# Altium schematic sheet LO.SchDoc
size A4
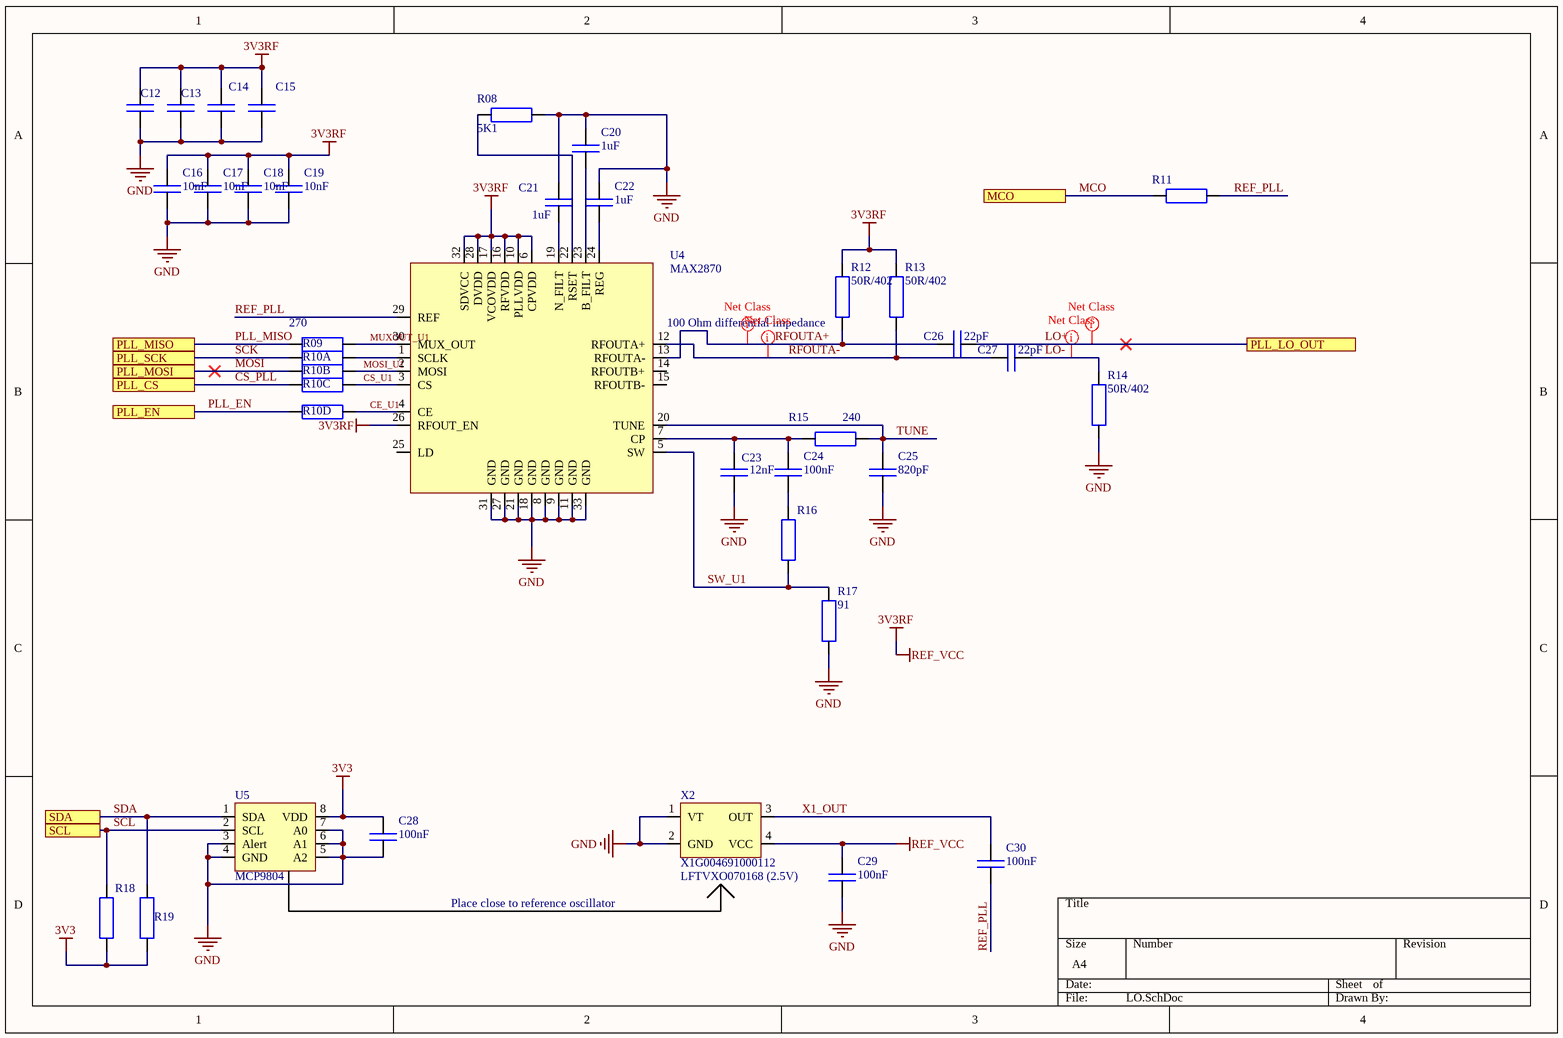
[diagram p0: LO.SchDoc]

## Parts
C12  100nF  [smd C0603_0.80]  (value not drawn)
C13  100nF  [smd C0603_0.80]  (value not drawn)
C14  100nF  [smd C0603_0.80]  (value not drawn)
C15  100nF  [smd C0603_0.80]  (value not drawn)
C16  10nF  [smd C0402]
C17  10nF  [smd C0402]
C18  10nF  [smd C0402]
C19  10nF  [smd C0402]
C20  1uF  [smd C0603_0.80]
C21  1uF  [smd C0603_0.80]
C22  1uF  [smd C0603_0.80]
C23  12nF  [smd C0603_0.80]
C24  100nF  [smd C0603_0.80]
C25  820pF  [smd C0603_0.80]
C26  22pF  [smd C0402]
C27  22pF  [smd C0402]
C28  100nF  [smd C0603_0.80]
C29  100nF  [smd C0603_0.80]
C30  100nF  [smd C0603_0.80]
R08  5K1  [smd C0603_0.45]
R09  270  [smd C0805_0.50]
R10  (no value)  [smd R EXB38v]  (parts A,B,C,D of 4)
R11  (no value)  [smd C0805_0.50]
R12  50R/402  [smd C0402_0.35]
R13  50R/402  [smd C0402_0.35]
R14  50R/402  [smd C0402_0.35]
R15  240  [smd C0603_0.45]
R16  (no value)  [smd C0603_0.45]
R17  91  [smd C0603_0.45]
R18  (no value)  [smd C0805_0.50]
R19  (no value)  [smd C0805_0.50]
U4  MAX2870  [MAXIM-T3255]
U5  MCP9804  [smd MSOP/8]
X2  X1G004691000112  [X1G004691000112]

## Ports
MCO, PLL_CS, PLL_EN, PLL_LO_OUT, PLL_MISO, PLL_MOSI, PLL_SCK, SCL, SDA

## Nets
3V3: C28.2 R18.2 R19.1 U5.8(VDD)
3V3RF: C12.2 C13.2 C14.2 C15.2 C16.2 C17.2 C18.2 C19.2 C29.2 R12.2 R13.2 U4.6(CPVDD) U4.10(PLLVDD) U4.16(RFVDD) U4.17(VCOVDD) U4.26(RFOUT_EN) U4.28(DVDD) U4.32(SDVCC) X2.4(VCC)  [also labelled REF_VCC]
GND: C12.1 C13.1 C14.1 C15.1 C16.1 C17.1 C18.1 C19.1 C20.1 C21.1 C22.1 C23.1 C25.1 C28.1 C29.1 R08.1 R14.1 R17.1 U4.8(GND) U4.9(GND) U4.11(GND) U4.18(GND) U4.21(GND) U4.27(GND) U4.31(GND) U4.33(GND) U5.3(Alert) U5.4(GND) U5.5(A2) U5.6(A1) U5.7(A0) X2.1(VT) X2.2(GND)
CE_U1: R10.8 U4.4(CE)
CS_PLL: R10.5 ; port PLL_CS
CS_U1: R10.6 U4.3(CS)
LO+: C26.2 ; port PLL_LO_OUT
LO-: C27.2 R14.2
MCO: R11.2 ; port MCO
MOSI: R10.3 ; port PLL_MOSI
MOSI_U1: R10.4 U4.2(MOSI)
MUXOUT_U1: R09.2 U4.30(MUX_OUT)
PLL_EN: R10.7 ; port PLL_EN
PLL_MISO: R09.1 ; port PLL_MISO
REF_PLL: C30.2 R11.1 U4.29(REF)
RFOUTA+: C26.1 R12.1 U4.13(RFOUTA-)
RFOUTA-: C27.1 R13.1 U4.12(RFOUTA+)
SCK: R10.1 ; port PLL_SCK
SCL: R18.1 U5.2(SCL) ; port SCL
SDA: R19.2 U5.1(SDA) ; port SDA
SW_U1: R16.1 R17.2 U4.5(SW)
TUNE: C25.2 R15.2 U4.20(TUNE)
X1_OUT: C30.1 X2.3(OUT)
NetC20_2: C20.2 U4.23(B_FILT)
NetC21_2: C21.2 U4.19(N_FILT)
NetC22_2: C22.2 U4.24(REG)
NetC23_2: C23.2 C24.2 R15.1 U4.7(CP)
NetC24_1: C24.1 R16.2
NetR08_2: R08.2 U4.22(RSET)
NetR10_2: R10.2 U4.1(SCLK)

Not connected (* = marked no-connect by the designer): U4 14(RFOUTB+) 15(RFOUTB-) 25(LD)

## Layout directives
net class RF: LO+, LO-, RFOUTA+, RFOUTA-

## Notes on the sheet
- (near R12) 100 Ohm differential impedance
- Place close to reference oscillator
- (near X2) LFTVXO070168 (2.5V)

## Library data of the parts
C12-C15 C24 C28-C30 = CSMD603/100nF: smd capaciteit, verp.0603, 100nF; Part Number: CSMD603/100nF; Component Kind: Standard; Component Type: Standard; Pin Count: 2; Supplier 1: Farnell
  C12-C15 C28-C30: Designator: CSMD603/100nF
C16-C19 = CSMD402/10nF: smd capaciteit, verp.0402, 10nF; Part Number: CSMD402/10nF; Component Kind: Standard; Component Type: Standard; Pin Count: 2; Supplier 1: Farnell
C20-C22 = CSMD603/1uF: smd capaciteit, verp.0603, 1uF; Part Number: CSMD603/18nF; Component Kind: Standard; Component Type: Standard; Designator: CSMD603/18nF; Library Reference: CSMD603/18nF; Pin Count: 2
C23 = CSMD603/12nF: smd capaciteit, verp.0603, 12nF; Part Number: CSMD603/12nF; Component Kind: Standard; Component Type: Standard; Designator: CSMD603/12nF; Pin Count: 2
C25 = CSMD603/820pF: smd capaciteit, verp.0603, 820pF; Part Number: CSMD603/820pF; Component Kind: Standard; Component Type: Standard; Pin Count: 2; Supplier 1: Farnell
C26 C27 = CSMD402/22pF: smd capaciteit, verp.0402, 22pF; Part Number: CSMD402/22pF; Component Kind: Standard; Component Type: Standard; Designator: CSMD402/22pF; Pin Count: 2; Supplier 1: Farnell
R08 = 5K1/603: weerstand SMD603, 5K1
R09 R11 = 270R/805: weerstand SMD805, 270R
R10 = 22R/Network4/603: weerstandsnetwerk SMD603, 4x 22R; Supplier 1: Farnell
R12-R14 = 50R/402: weerstand SMD402, 50R; Supplier 1: Farnell
R15 = 240K/603: weerstand SMD603, 240K
R16 = 30R/603: weerstand SMD603, 30R; Supplier 1: Farnell
R17 = 91R/603: weerstand SMD603, 91R; Supplier 1: Farnell
R18 R19 = 1K8/805: weerstand SMD805, 1K8
U5 = MCP9804: ±0.25°C Typical Accuracy Digital Temperature Sensor; Supplier 1: Farnell